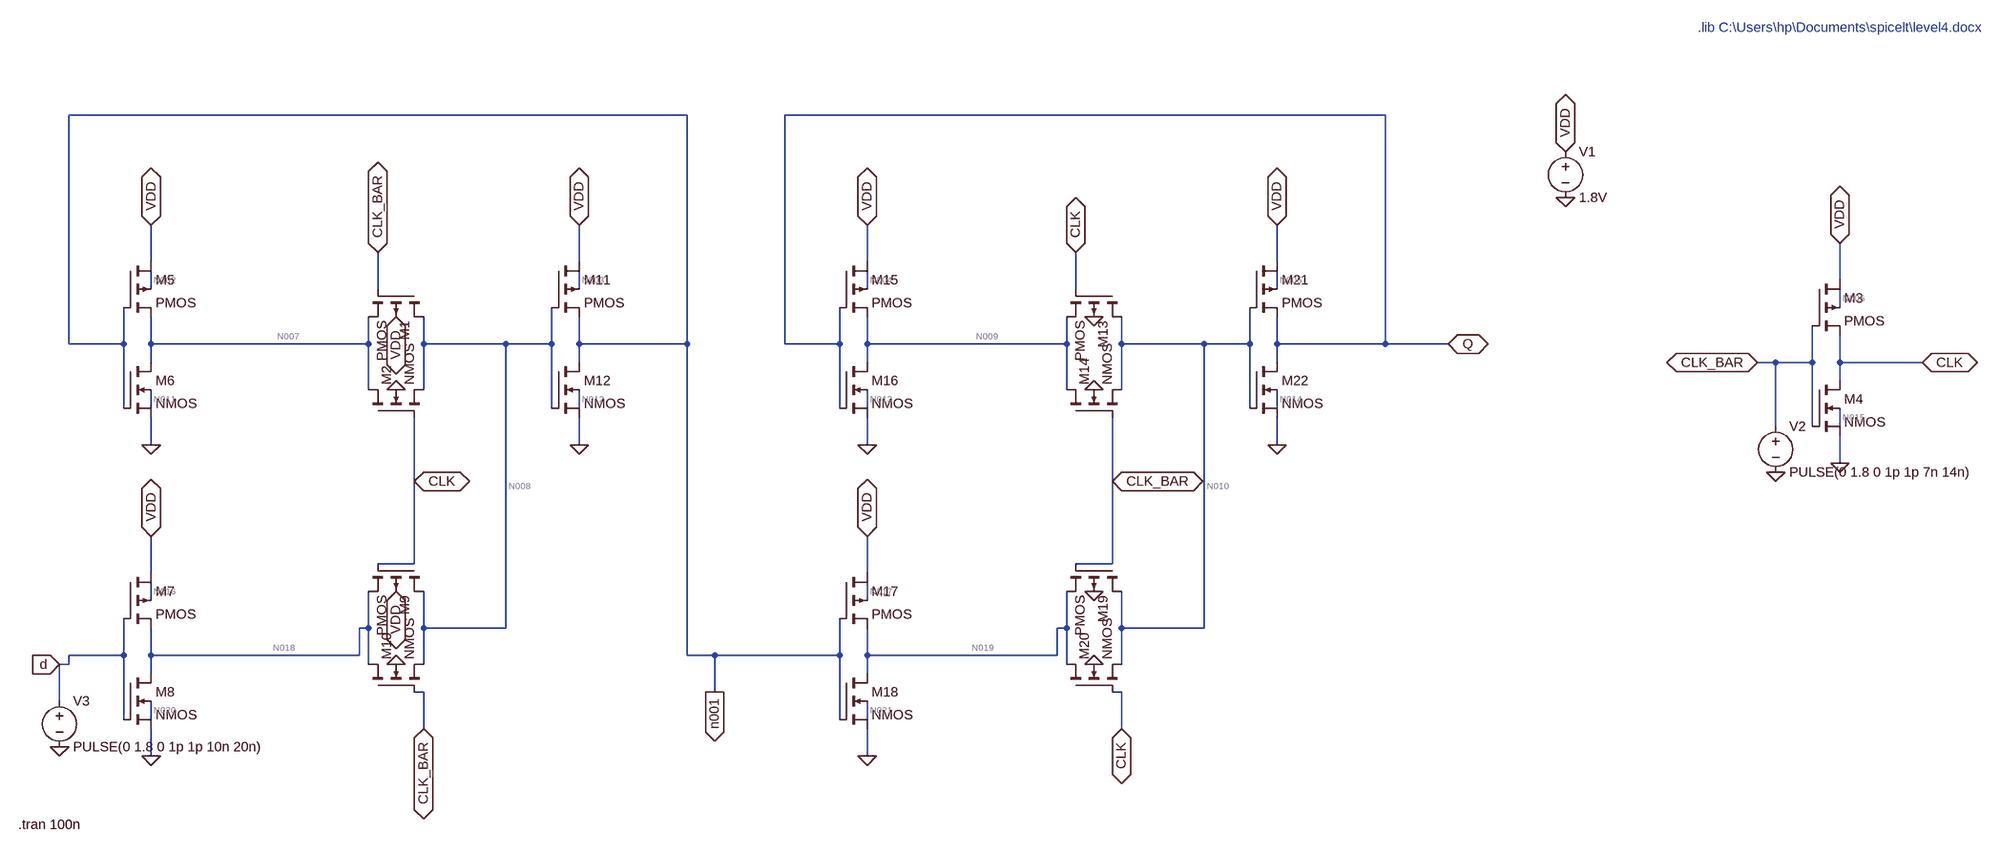
[diagram p0: schematic master_slave_flipflop.asc]
master_slave_flipflop.asc, the LTspice schematic file:
Version 4
SHEET 1 2728 1132
WIRE -208 -128 -1472 -128
WIRE 1248 -128 -16 -128
WIRE -1328 128 -1328 64
WIRE -480 128 -480 64
WIRE 128 128 128 64
WIRE 976 128 976 64
WIRE 2224 160 2224 96
WIRE -1328 176 -1328 144
WIRE -832 176 -832 112
WIRE -480 176 -480 144
WIRE 128 176 128 144
WIRE 624 176 624 112
WIRE 976 176 976 144
WIRE 2224 208 2224 176
WIRE -1472 272 -1472 -128
WIRE -1376 272 -1376 208
WIRE -1376 272 -1472 272
WIRE -1328 272 -1328 224
WIRE -848 272 -848 224
WIRE -848 272 -1328 272
WIRE -752 272 -752 224
WIRE -608 272 -752 272
WIRE -528 272 -528 208
WIRE -528 272 -608 272
WIRE -480 272 -480 224
WIRE -208 272 -208 -128
WIRE -208 272 -480 272
WIRE -16 272 -16 -128
WIRE 80 272 80 208
WIRE 80 272 -16 272
WIRE 128 272 128 224
WIRE 608 272 608 224
WIRE 608 272 128 272
WIRE 704 272 704 224
WIRE 848 272 704 272
WIRE 928 272 928 208
WIRE 928 272 848 272
WIRE 976 272 976 224
WIRE 1248 272 1248 -128
WIRE 1248 272 976 272
WIRE 1360 272 1248 272
WIRE -1328 304 -1328 272
WIRE -480 304 -480 272
WIRE 128 304 128 272
WIRE 976 304 976 272
WIRE 2112 304 2080 304
WIRE 2176 304 2176 240
WIRE 2176 304 2112 304
WIRE 2224 304 2224 256
WIRE 2368 304 2224 304
WIRE 2224 336 2224 304
WIRE -848 352 -848 272
WIRE -752 352 -752 272
WIRE 608 352 608 272
WIRE 704 352 704 272
WIRE -1376 384 -1376 272
WIRE -1328 384 -1328 352
WIRE -528 384 -528 272
WIRE -480 384 -480 352
WIRE 80 384 80 272
WIRE 128 384 128 352
WIRE 928 384 928 272
WIRE 976 384 976 352
WIRE 2112 416 2112 304
WIRE 2176 416 2176 304
WIRE 2224 416 2224 384
WIRE -1328 448 -1328 400
WIRE -480 448 -480 400
WIRE 128 448 128 400
WIRE 976 448 976 400
WIRE 2224 480 2224 432
WIRE -768 512 -768 400
WIRE 688 512 688 400
WIRE -768 656 -768 512
WIRE -768 656 -832 656
WIRE 688 656 688 512
WIRE 688 656 624 656
WIRE -1328 672 -1328 608
WIRE 128 672 128 608
WIRE -1328 720 -1328 688
WIRE 128 720 128 688
WIRE -848 768 -848 704
WIRE -848 768 -864 768
WIRE -752 768 -752 704
WIRE -608 768 -608 272
WIRE -608 768 -752 768
WIRE 608 768 608 704
WIRE 608 768 592 768
WIRE 704 768 704 704
WIRE 848 768 848 272
WIRE 848 768 704 768
WIRE -1376 816 -1376 752
WIRE -1376 816 -1472 816
WIRE -1328 816 -1328 768
WIRE -864 816 -864 768
WIRE -864 816 -1328 816
WIRE -208 816 -208 272
WIRE -160 816 -208 816
WIRE 80 816 80 752
WIRE 80 816 -160 816
WIRE 128 816 128 768
WIRE 592 816 592 768
WIRE 592 816 128 816
WIRE -1472 832 -1472 816
WIRE -1472 832 -1488 832
WIRE -848 832 -848 768
WIRE -752 832 -752 768
WIRE 608 832 608 768
WIRE 704 832 704 768
WIRE -1328 848 -1328 816
WIRE 128 848 128 816
WIRE -752 880 -768 880
WIRE -160 880 -160 816
WIRE 704 880 688 880
WIRE -1488 896 -1488 832
WIRE -1376 928 -1376 816
WIRE -1328 928 -1328 896
WIRE 80 928 80 816
WIRE 128 928 128 896
WIRE -752 944 -752 880
WIRE 704 944 704 880
WIRE -1328 992 -1328 944
WIRE 128 992 128 944
FLAG 2224 480 0
FLAG 2080 304 CLK_BAR
IOPIN 2080 304 BiDir
FLAG 2224 96 VDD
IOPIN 2224 96 BiDir
FLAG 2368 304 CLK
IOPIN 2368 304 BiDir
FLAG 1728 -64 VDD
IOPIN 1728 -64 BiDir
FLAG 1728 16 0
FLAG -800 352 0
FLAG 2112 496 0
FLAG -1328 448 0
FLAG -1328 64 VDD
IOPIN -1328 64 BiDir
FLAG -1328 992 0
FLAG -1328 608 VDD
IOPIN -1328 608 BiDir
FLAG -1488 976 0
FLAG -1488 832 d
IOPIN -1488 832 In
FLAG -800 832 0
FLAG -768 512 CLK
IOPIN -768 512 BiDir
FLAG -832 112 CLK_BAR
IOPIN -832 112 BiDir
FLAG -752 944 CLK_BAR
IOPIN -752 944 BiDir
FLAG -480 448 0
FLAG -480 64 VDD
IOPIN -480 64 BiDir
FLAG 656 224 0
FLAG 656 352 0
FLAG 128 448 0
FLAG 128 64 VDD
IOPIN 128 64 BiDir
FLAG 128 992 0
FLAG 128 608 VDD
IOPIN 128 608 BiDir
FLAG 656 704 0
FLAG 656 832 0
FLAG 976 448 0
FLAG 976 64 VDD
IOPIN 976 64 BiDir
FLAG -800 224 VDD
IOPIN -800 224 BiDir
FLAG -800 704 VDD
IOPIN -800 704 BiDir
FLAG 624 112 CLK
IOPIN 624 112 BiDir
FLAG 688 512 CLK_BAR
IOPIN 688 512 BiDir
FLAG 704 944 CLK
IOPIN 704 944 BiDir
FLAG 1360 272 Q
IOPIN 1360 272 BiDir
FLAG -160 880 n001
IOPIN -160 880 Out
SYMBOL pmos4 2176 160 R0
SYMATTR InstName M3
SYMATTR Value2 l=180nm w=1200nm
SYMBOL nmos4 2176 336 R0
SYMATTR InstName M4
SYMATTR Value2 l=180nm w=300nm
SYMBOL voltage 1728 -80 R0
WINDOW 123 0 0 Left 0
WINDOW 39 0 0 Left 0
SYMATTR InstName V1
SYMATTR Value 1.8V
SYMBOL pmos4 -752 176 R90
SYMATTR InstName M1
SYMATTR Value2 l=180nm w=1200nm
SYMBOL nmos4 -848 400 R270
SYMATTR InstName M2
SYMATTR Value2 l=180nm w=300nm
SYMBOL voltage 2112 400 R0
WINDOW 123 0 0 Left 0
WINDOW 39 0 0 Left 0
SYMATTR InstName V2
SYMATTR Value PULSE(0 1.8 0 1p 1p 7n 14n)
SYMBOL pmos4 -1376 128 R0
SYMATTR InstName M5
SYMATTR Value2 l=180nm w=1200nm
SYMBOL nmos4 -1376 304 R0
SYMATTR InstName M6
SYMATTR Value2 l=180nm w=300nm
SYMBOL pmos4 -1376 672 R0
SYMATTR InstName M7
SYMATTR Value2 l=180nm w=1200nm
SYMBOL nmos4 -1376 848 R0
SYMATTR InstName M8
SYMATTR Value2 l=180nm w=300nm
SYMBOL voltage -1488 880 R0
WINDOW 123 0 0 Left 0
WINDOW 39 0 0 Left 0
SYMATTR InstName V3
SYMATTR Value PULSE(0 1.8 0 1p 1p 10n 20n)
SYMBOL pmos4 -752 656 R90
SYMATTR InstName M9
SYMATTR Value2 l=180nm w=1200nm
SYMBOL nmos4 -848 880 R270
SYMATTR InstName M10
SYMATTR Value2 l=180nm w=300nm
SYMBOL pmos4 -528 128 R0
SYMATTR InstName M11
SYMATTR Value2 l=180nm w=1200nm
SYMBOL nmos4 -528 304 R0
SYMATTR InstName M12
SYMATTR Value2 l=180nm w=300nm
SYMBOL pmos4 704 176 R90
SYMATTR InstName M13
SYMATTR Value2 l=180nm w=1200nm
SYMBOL nmos4 608 400 R270
SYMATTR InstName M14
SYMATTR Value2 l=180nm w=300nm
SYMBOL pmos4 80 128 R0
SYMATTR InstName M15
SYMATTR Value2 l=180nm w=1200nm
SYMBOL nmos4 80 304 R0
SYMATTR InstName M16
SYMATTR Value2 l=180nm w=300nm
SYMBOL pmos4 80 672 R0
SYMATTR InstName M17
SYMATTR Value2 l=180nm w=1200nm
SYMBOL nmos4 80 848 R0
SYMATTR InstName M18
SYMATTR Value2 l=180nm w=300nm
SYMBOL pmos4 704 656 R90
SYMATTR InstName M19
SYMATTR Value2 l=180nm w=1200nm
SYMBOL nmos4 608 880 R270
SYMATTR InstName M20
SYMATTR Value2 l=180nm w=300nm
SYMBOL pmos4 928 128 R0
SYMATTR InstName M21
SYMATTR Value2 l=180nm w=1200nm
SYMBOL nmos4 928 304 R0
SYMATTR InstName M22
SYMATTR Value2 l=180nm w=300nm
TEXT 1976 -632 Left 2 ;.lib C:\\Users\\hp\\Documents\\spicelt\\level4.docx
TEXT -1560 1112 Left 2 !.tran 100n

The netlist it stands for:
* master_slave_flipflop.asc
M3 VDD CLK_BAR CLK N006 PMOS l=180nm w=1200nm
M4 CLK CLK_BAR 0 N015 NMOS l=180nm w=300nm
V1 VDD 0 1.8V
M1 N008 CLK_BAR N007 VDD PMOS l=180nm w=1200nm
M2 N007 CLK N008 0 NMOS l=180nm w=300nm
V2 CLK_BAR 0 PULSE(0 1.8 0 1p 1p 7n 14n)
M5 VDD n001 N007 N002 PMOS l=180nm w=1200nm
M6 N007 n001 0 N011 NMOS l=180nm w=300nm
M7 VDD d N018 N016 PMOS l=180nm w=1200nm
M8 N018 d 0 N020 NMOS l=180nm w=300nm
V3 d 0 PULSE(0 1.8 0 1p 1p 10n 20n)
M9 N008 CLK N018 VDD PMOS l=180nm w=1200nm
M10 N018 CLK_BAR N008 0 NMOS l=180nm w=300nm
M11 VDD N008 n001 N003 PMOS l=180nm w=1200nm
M12 n001 N008 0 N012 NMOS l=180nm w=300nm
M13 N010 CLK N009 0 PMOS l=180nm w=1200nm
M14 N009 CLK_BAR N010 0 NMOS l=180nm w=300nm
M15 VDD Q N009 N004 PMOS l=180nm w=1200nm
M16 N009 Q 0 N013 NMOS l=180nm w=300nm
M17 VDD n001 N019 N017 PMOS l=180nm w=1200nm
M18 N019 n001 0 N021 NMOS l=180nm w=300nm
M19 N010 CLK_BAR N019 0 PMOS l=180nm w=1200nm
M20 N019 CLK N010 0 NMOS l=180nm w=300nm
M21 VDD N010 Q N005 PMOS l=180nm w=1200nm
M22 Q N010 0 N014 NMOS l=180nm w=300nm
.model NMOS NMOS
.model PMOS PMOS
.lib standard.mos
* .lib C:\Users\hp\Documents\spicelt\level4.docx
.tran 100n
.backanno
.end

* Results of the author's LTspice run, read from the files saved beside the schematic
* Operating Point, zero values left out:
*   V(vdd) = 1.8 V
*   V(clk) = 1.8 V
*   V(n006) = 1.689 V
*   V(n015) = 128.4 mV
*   V(n008) = 1.2 V
*   V(n007) = 1.2 V
*   V(n001) = 1.2 V
*   V(n002) = 1.663 V
*   V(n011) = 115.6 mV
*   V(n018) = 1.8 V
*   V(n016) = 1.689 V
*   V(n020) = 128.4 mV
*   V(n003) = 1.663 V
*   V(n012) = 115.6 mV
*   V(n010) = 488 mV
*   V(n009) = 589.6 µV
*   V(q) = 1.777 V
*   V(n004) = 1.651 V
*   V(n013) = 216.3 µV
*   V(n019) = 516.3 mV
*   V(n017) = 1.655 V
*   V(n021) = 86.02 mV
*   V(n005) = 1.68 V
*   V(n014) = 128.1 mV
*   Id(M3) = 5.17 pA
*   Ib(M3) = -1.689 pA
*   Is(M3) = -3.482 pA
*   Ib(M1) = 1.22 pA
*   Id(M5) = 24 µA
*   Ib(M5) = -1.663 pA
*   Is(M5) = -24 µA
*   Id(M7) = 8.18 pA
*   Ib(M7) = -1.689 pA
*   Is(M7) = -6.492 pA
*   Id(M9) = -1.21 pA
*   Id(M11) = 24 µA
*   Ib(M11) = -1.663 pA
*   Is(M11) = -24 µA
*   Id(M13) = 1.561 µA
*   Ib(M13) = -1.561 µA
*   Id(M15) = 34.92 nA
*   Ib(M15) = -1.651 pA
*   Is(M15) = -34.92 nA
*   Id(M17) = 24 µA
*   Ib(M17) = -1.655 pA
*   Is(M17) = -24 µA
*   Id(M19) = -335.6 nA
*   Ib(M19) = -6.229 µA
*   Is(M19) = 6.565 µA
*   Id(M21) = 3.969 µA
*   Ib(M21) = -1.68 pA
*   Is(M21) = -3.969 µA
*   Id(M4) = 3.482 pA
*   Is(M4) = -3.353 pA
*   Id(M2) = 1.21 pA
*   Ib(M2) = -2.42 pA
*   Is(M2) = 1.21 pA
*   Id(M6) = 24 µA
*   Is(M6) = -24 µA
*   Id(M8) = 3.482 pA
*   Is(M8) = -3.353 pA
*   Id(M10) = 2.41 pA
*   Ib(M10) = -3.02 pA
*   Id(M12) = 24 µA
*   Is(M12) = -24 µA
*   Id(M16) = 34.92 nA
*   Is(M16) = -34.92 nA
*   Id(M18) = 16.21 µA
*   Is(M18) = -16.21 µA
*   Id(M20) = 1.226 µA
*   Ib(M20) = -1.024 pA
*   Is(M20) = -1.226 µA
*   Id(M22) = 3.969 µA
*   Is(M22) = -3.969 µA
*   I(V1) = -76 µA
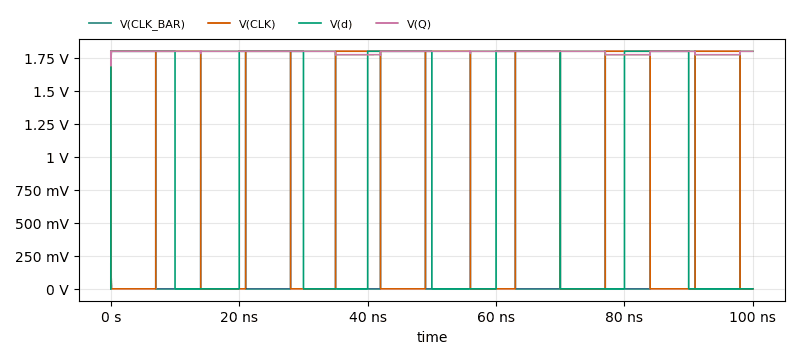
[diagram p1: Transient Analysis of master_slave_flipflop.asc, plotted from the saved traces]
* Transient Analysis, 1 run:
*   V(CLK_BAR): min 0 V, max 1.8 V, average 918.1 mV, rms 1.286 V, last 1.8 V
*   V(CLK): min 0 V, max 1.8 V, average 882 mV, rms 1.26 V, last 0 V
*   V(d): min 0 V, max 1.8 V, average 900.1 mV, rms 1.273 V, last 0 V
*   V(Q): min 1.69 V, max 1.8 V, average 1.794 V, rms 1.794 V, last 1.8 V